# EAGLE design D-ad SIL-DIL V1.1 (EAGLE 6.4)
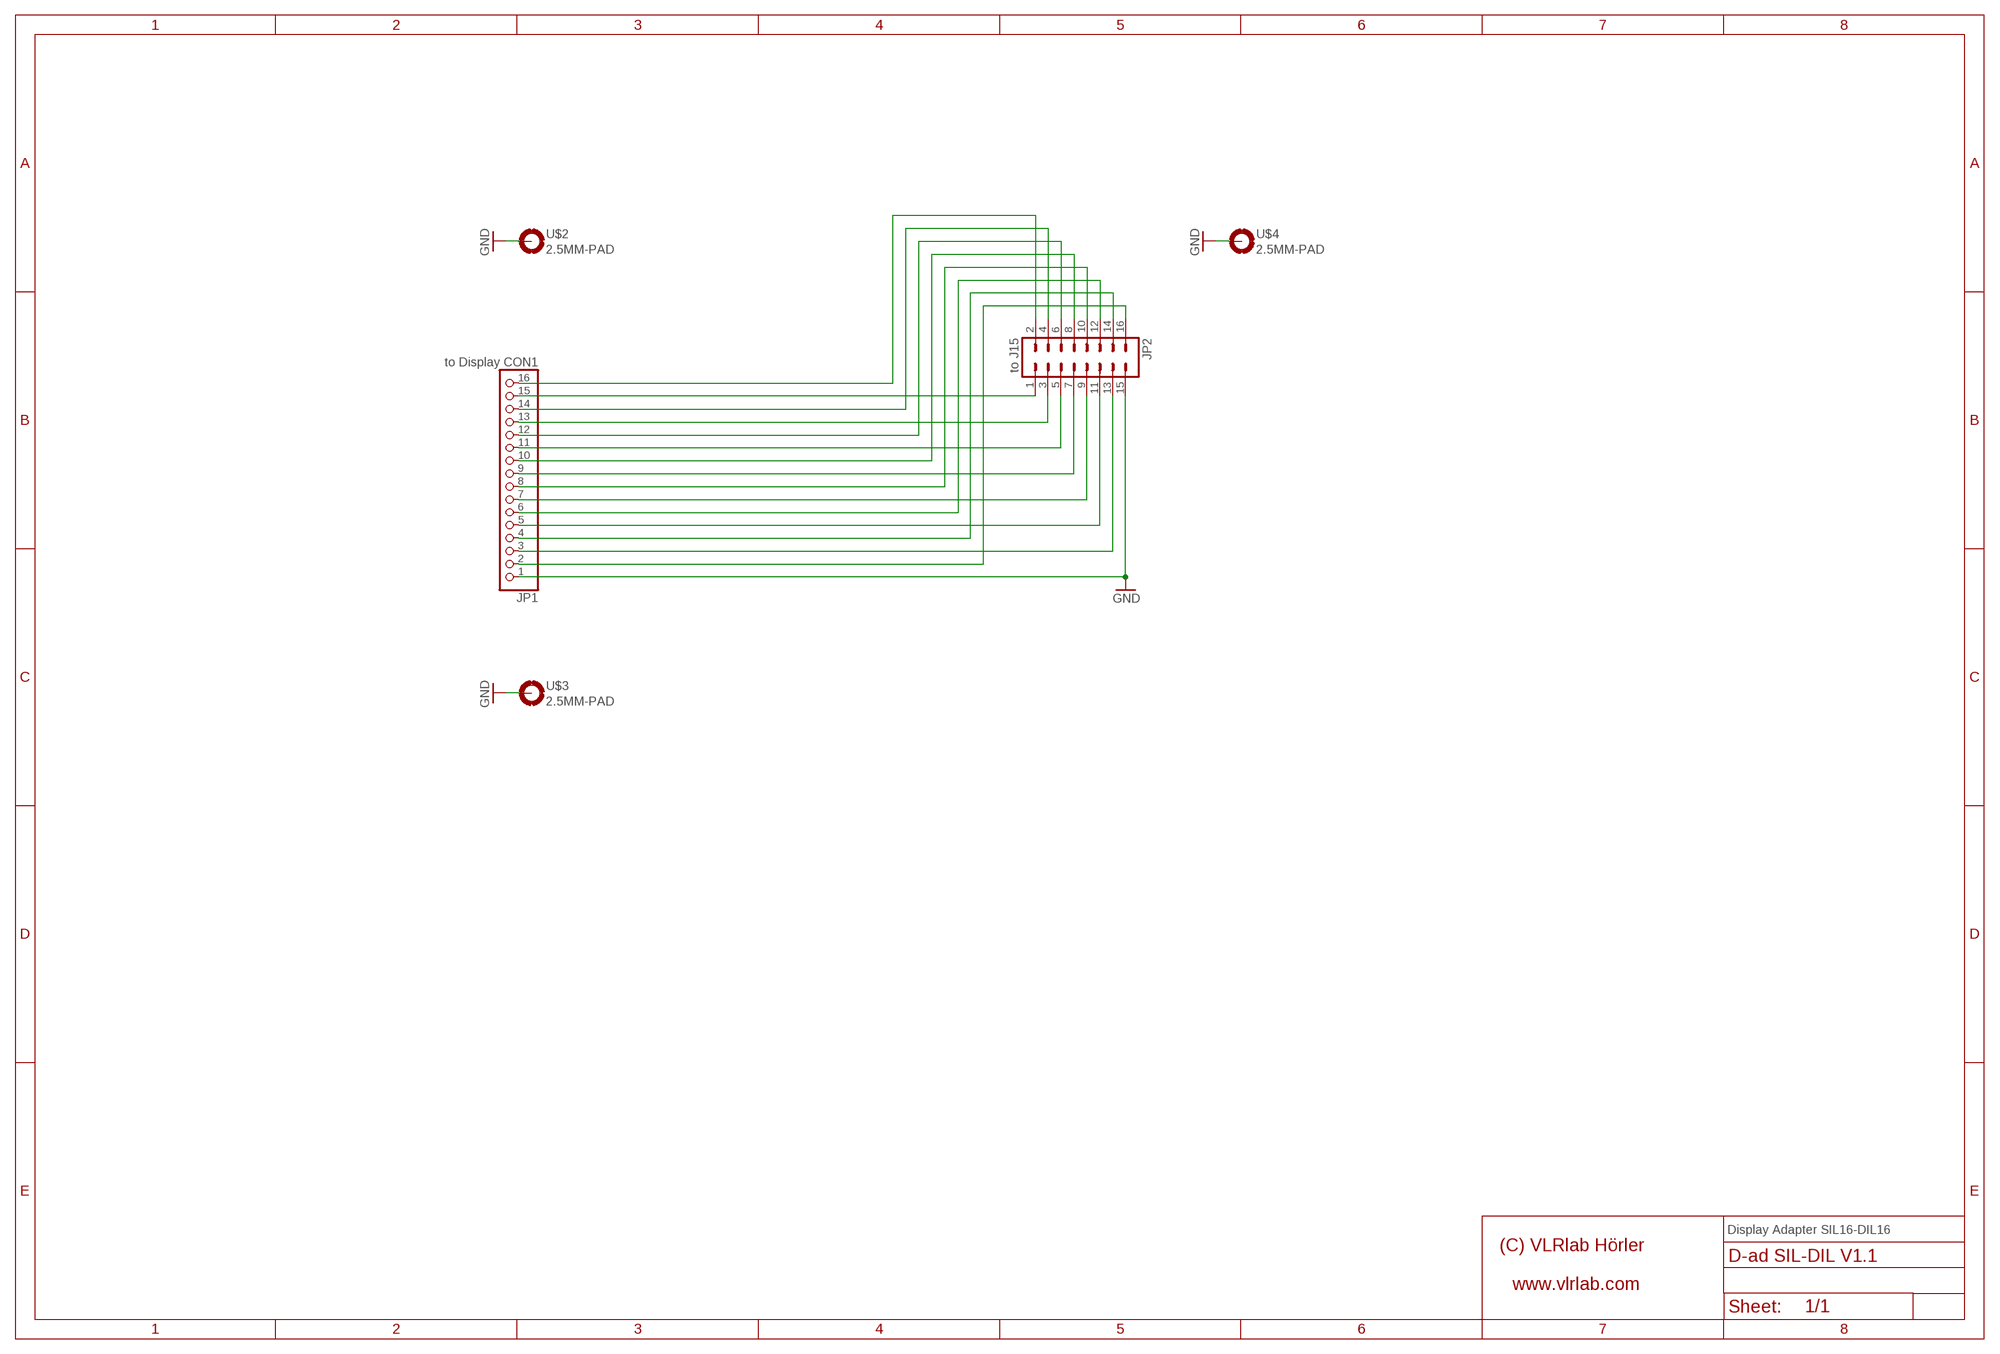
[diagram p0: schematic, sheet 1]

## Parts
JP1  to Display CON1  PINHD-1X16  [1X16]
JP2  to J15  ML16  [ML16]
U$2  2.5MM-PAD  [2.5MM-PAD]
U$3  2.5MM-PAD  [2.5MM-PAD]
U$4  2.5MM-PAD  [2.5MM-PAD]

## Nets
DB0: JP1.7 JP2.9
DB1: JP1.8 JP2.10
DB2: JP1.9 JP2.7
DB3: JP1.10 JP2.8
DB4: JP1.11 JP2.5
DB5: JP1.12 JP2.6
DB6: JP1.13 JP2.3
DB7: JP1.14 JP2.4
E: JP1.6 JP2.12
GND: JP1.1 JP2.15 U$2.B3,2(MOUNT) U$3.B3,2(MOUNT) U$4.B3,2(MOUNT)
N$1: JP1.15 JP2.1
N.C: JP1.3 JP2.13
N.C3: JP1.16 JP2.2
R/W: JP1.5 JP2.11
RS: JP1.4 JP2.14
VCC: JP1.2 JP2.16

## Notes on the sheet
- Display Adapter SIL16-DIL16

## Library data of the parts
JP1 = pinhead_Ivan:PINHD-1X16: PIN HEADER
JP2 = con-ml:ML16: HARTING; OC_FARNELL: unknown; OC_NEWARK: unknown
U$2-U$4 = holes_Ivan:2.5MM-PAD

## Board
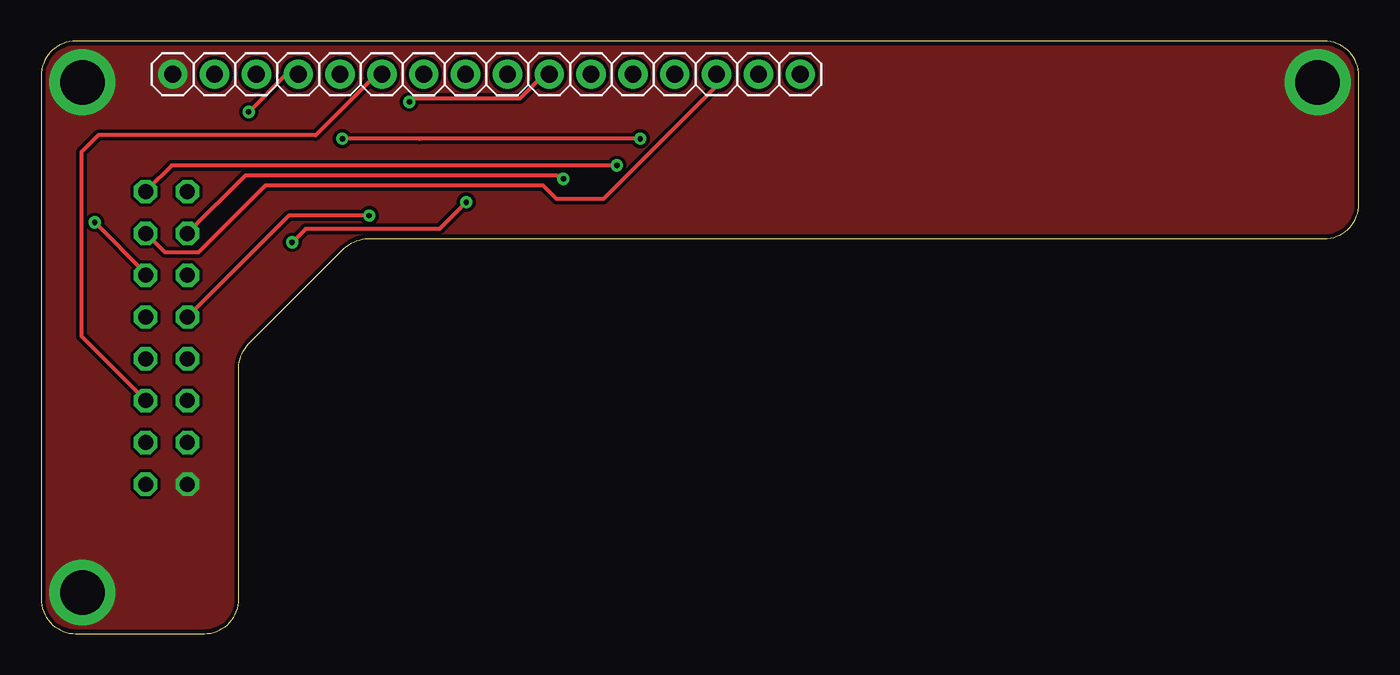
[diagram p1: board, top side]
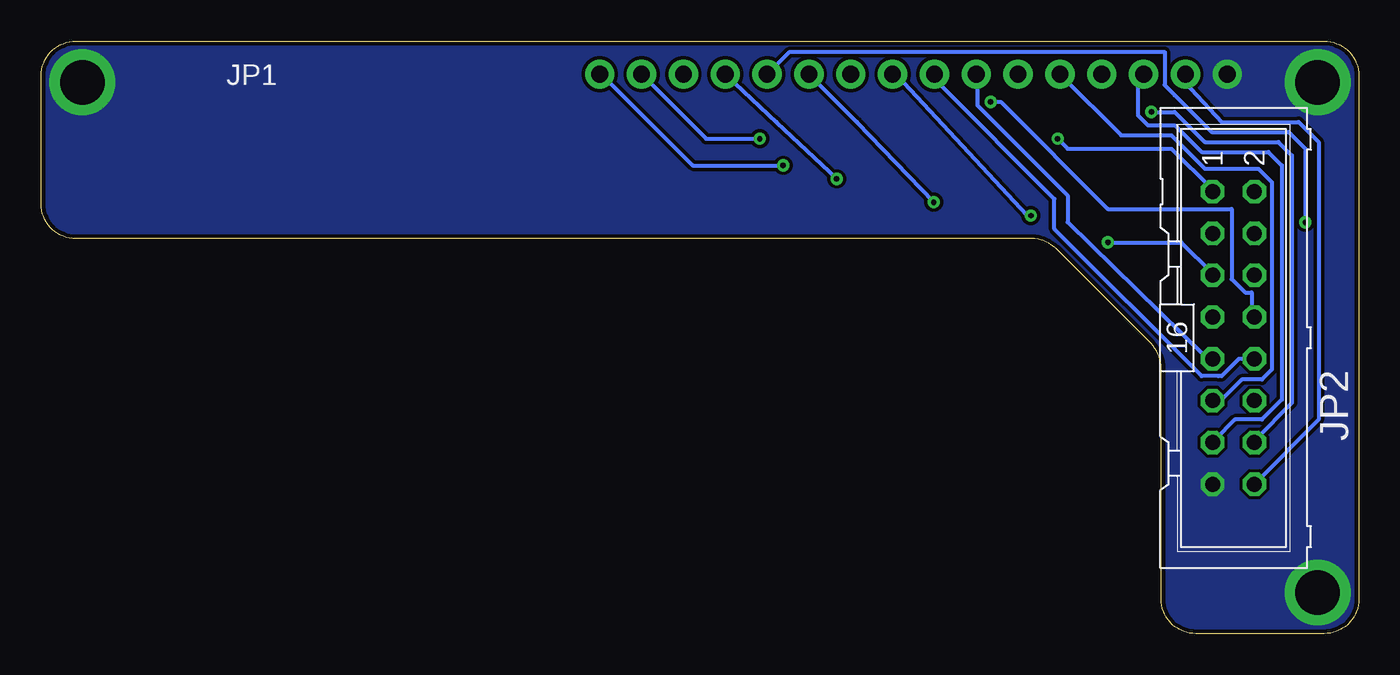
[diagram p2: board, bottom side, seen from below]

Size 80 x 36 mm. Coordinates in mm from the lower left corner, seen from the top.
Outline: 2.1,0 9.9,0 arc90 12,2.1 12,16.13 arc-45 12.62,17.61 18.39,23.39 arc-45 19.87,24 77.9,24 arc90 80,26.1 80,33.9 arc90 77.9,36 2.1,36 arc90 0,33.9 0,2.1 arc90 2.1,0
Copper layers (1*16): Top 0.035mm / dielectric 1.5mm / Bottom 0.035mm
Design rules "default *": minimum track width 10mil, minimum drill 13mil, track to track 8mil, track to pad 8mil, pad to pad 8mil, via to via 8mil, smd to smd 8mil, copper to edge 10mil, drill to drill 8mil, minimum pad ring 10mil, minimum via ring 8mil, stop-mask expansion 4mil, vias tented up to drill 0mil, thermal gap 0mil

### Footprints (pad centres in the part's own frame; a part is rotated, then mirrored left to right if it is on the bottom)
1X16 = drill 1.016 pad 1.778: 1 -19.05,0; 2 -16.51,0; 3 -13.97,0; 4 -11.43,0; 5 -8.89,0; 6 -6.35,0; 7 -3.81,0; 8 -1.27,0; 9 1.27,0; 10 3.81,0; 11 6.35,0; 12 8.89,0; 13 11.43,0; 14 13.97,0; 15 16.51,0; 16 19.05,0
ML16 = drill 0.914 octagon: 1 -8.89,-1.27; 2 -8.89,1.27; 3 -6.35,-1.27; 4 -6.35,1.27; 5 -3.81,-1.27; 6 -3.81,1.27; 7 -1.27,-1.27; 8 -1.27,1.27; 9 1.27,-1.27; 10 1.27,1.27; 11 3.81,-1.27; 12 3.81,1.27; 13 6.35,-1.27; 14 6.35,1.27; 15 8.89,-1.27; 16 8.89,1.27
2.5MM-PAD = drill 2.7 pad 4: B3,2 0,0

### Placement (x,y rotation side)
JP1  27.04,33.99 0 top
JP2  7.61,17.97 270 bottom
U$2  2.5,33.5 0 top
U$3  2.5,2.5 0 top
U$4  77.5,33.5 0 top
U$5  [VLRLAB]  74.57,25.81 0 bottom
U$6  [DAD-SILDIL]  74.68,28.04 0 bottom

### Tracks (layer width: path | path; a pad name or v marks a point on that pad's centre or on a via)
DB0
  Bottom 0.254: JP2.9 8.94,16.66 9.35,16.87 17.68,24.99 17.68,26.62 18.49,27.43 23.16,32.11 23.16,33.93 JP1.7
DB1
  Bottom 0.254: JP1.8 25.6,33.93 25.6,33.53 18.49,26.42 18.49,24.59 9.55,15.65 8.53,15.65 8.33,15.65 7.28,16.7 JP2.10
DB2  (via drill 0.33)
  Top 0.254: v19.91,25.4 15.04,25.4 8.94,19.3 JP2.7
  Bottom 0.254: v19.91,25.4 20.12,25.4 28.04,33.93 28.25,33.93 JP1.9
DB3  (via drill 0.33)
  Top 0.254: v22.35,32.31 22.55,32.51 29.06,32.51 30.48,33.93 30.68,33.93 JP1.10
  Bottom 0.254: v22.35,32.31 21.74,32.31 15.24,25.81 7.72,25.81 7.72,21.54 6.91,20.73 6.5,20.73 6.5,19.3 JP2.8
DB4  (via drill 0.33)
  Top 0.254: v15.24,23.77 16.05,24.59 24.18,24.59 v25.81,26.21
  Bottom 0.254: v15.24,23.77 10.77,23.77 8.94,21.95 JP2.5 | v25.81,26.21 30.48,31.09 33.33,33.93 JP1.11
DB5  (via drill 0.33)
  Top 0.254: v3.25,24.99 6.3,21.95 JP2.6
  Bottom 0.254: v3.25,24.99 3.25,29.46 4.27,30.48 8.94,30.48 11.18,32.72 11.79,33.33 11.79,35.36 34.54,35.36 35.76,34.14 JP1.12
DB6  (via drill 0.33)
  Top 0.254: v31.7,27.64 31.29,27.84 12.39,27.84 8.94,24.38 JP2.3
  Bottom 0.254: v31.7,27.64 35.36,31.09 38.41,33.93 JP1.13
DB7
  Top 0.254: JP2.4 6.5,24.18 7.52,23.16 9.55,23.16 13.61,27.23 30.48,27.23 31.29,26.42 34.14,26.42 41.66,33.93 JP1.14
E
  Top 0.254: JP2.12 6.3,14.22 2.44,18.09 2.44,29.26 3.45,30.28 16.66,30.28 20.32,33.93 20.52,33.93 JP1.6
GND
  pour Top: 0,2.1 0,33.9 arc-90 2.1,36 77.9,36 arc-90 80,33.9 80,26.1 arc-90 77.9,24 19.87,24 arc45 18.38,23.38 12.62,17.62 arc45 12,16.13 12,2.1 arc-90 9.9,0 2.1,0 arc-90
  pour Bottom: 0,2.1 0,33.9 arc-90 2.1,36 77.9,36 arc-90 80,33.9 80,26.1 arc-90 77.9,24 19.87,24 arc45 18.38,23.38 12.62,17.62 arc45 12,16.13 12,2.1 arc-90 9.9,0 2.1,0 arc-90
N$1  (via drill 0.33)
  Top 0.254: v18.29,30.07 22.96,30.07 v36.37,30.07
  Bottom 0.254: v18.29,30.07 17.68,29.46 11.38,29.46 8.94,27.03 JP2.1 | v36.37,30.07 39.62,30.07 43.48,33.93 JP1.15
N.C
  Bottom 0.254: JP2.13 8.74,11.79 7.52,13.01 5.89,13.01 4.67,14.22 4.67,28.45 5.49,29.26 9.55,29.26 11.18,30.89 12.8,30.89 13.41,31.5 13.41,33.93 13.21,33.93 JP1.3
N.C3  (via drill 0.33)
  Top 0.254: v34.95,28.45 7.92,28.45 6.5,27.03 JP2.2
  Bottom 0.254: v34.95,28.45 40.44,28.45 45.92,33.93 JP1.16
R/W
  Bottom 0.254: JP2.11 8.33,14.22 7.11,15.44 5.89,15.44 5.28,16.05 5.28,27.43 6.1,28.25 9.35,28.25 11.38,30.28 14.43,30.28 18.09,33.93 JP1.5
RS  (via drill 0.33)
  Top 0.254: v12.6,31.7 14.83,33.93 15.44,33.93 JP1.4
  Bottom 0.254: v12.6,31.7 11.18,31.7 9.35,29.87 4.88,29.87 4.06,29.06 4.06,14.02 6.3,11.79 JP2.14
VCC
  Bottom 0.254: JP2.16 6.3,9.14 2.44,13.01 2.44,29.87 3.66,31.09 8.33,31.09 10.97,33.93 JP1.2